# Altium schematic sheet DataDriven_sheet1_connections.SchDoc
size A3; SheetNumber: 1; SheetTotal: 4
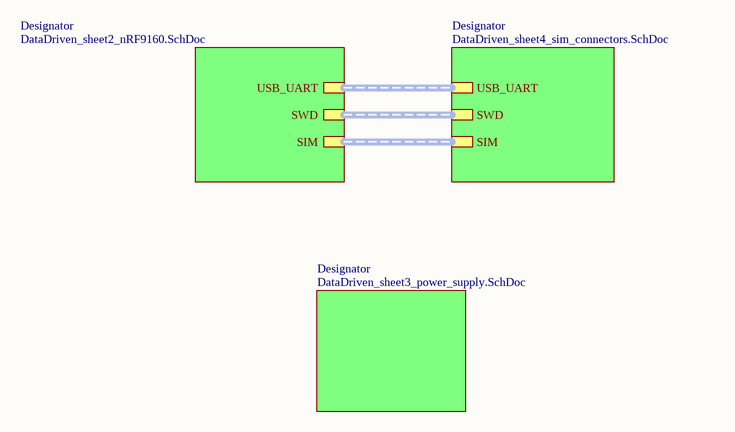
[diagram p0: DataDriven_sheet1_connections.SchDoc]

## Sub-sheets
Designator = DataDriven_sheet2_nRF9160.SchDoc: USB_UART (harness UART), SWD (harness SWD), SIM (harness SIM)
Designator = DataDriven_sheet4_sim_connectors.SchDoc: USB_UART (harness UART), SWD (harness SWD), SIM (harness SIM)
Designator = DataDriven_sheet3_power_supply.SchDoc: no entries